# EAGLE schematic Grove_-_Capacitive_Moisture_Sensor_(Corrosion_Resistant)_v1 (EAGLE 9.7.0)
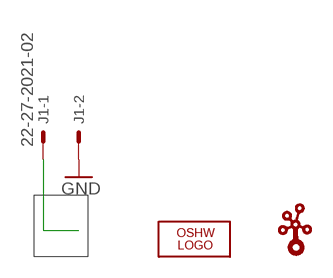
[diagram p0: schematic, sheet 1]

## Parts
J1  22-27-2021-02  [6410-02]
LOGO1  LOGO-OSHW-FILLX0200-NT  [OSHW_FILLX200_NOTEXT]
U$7  LOGO-GROVE  [GROVE-SILK-BIG]

## Nets
GND: J1.2
N$5: J1.1

## Library data of the parts
J1 = con-molex:22-?-02: CONNECTOR wire to board 2.54 mm (.1 inch) pitch header; MF: MOLEX; OC_FARNELL: unknown; OC_NEWARK: unknown
LOGO1 = logo:LOGO-OSHW-FILL; PARTNO: DNP
U$7 = logo:LOGO-GROVE; PARTNO: DNP